# EAGLE design MS-v4.1 (EAGLE 5.00)
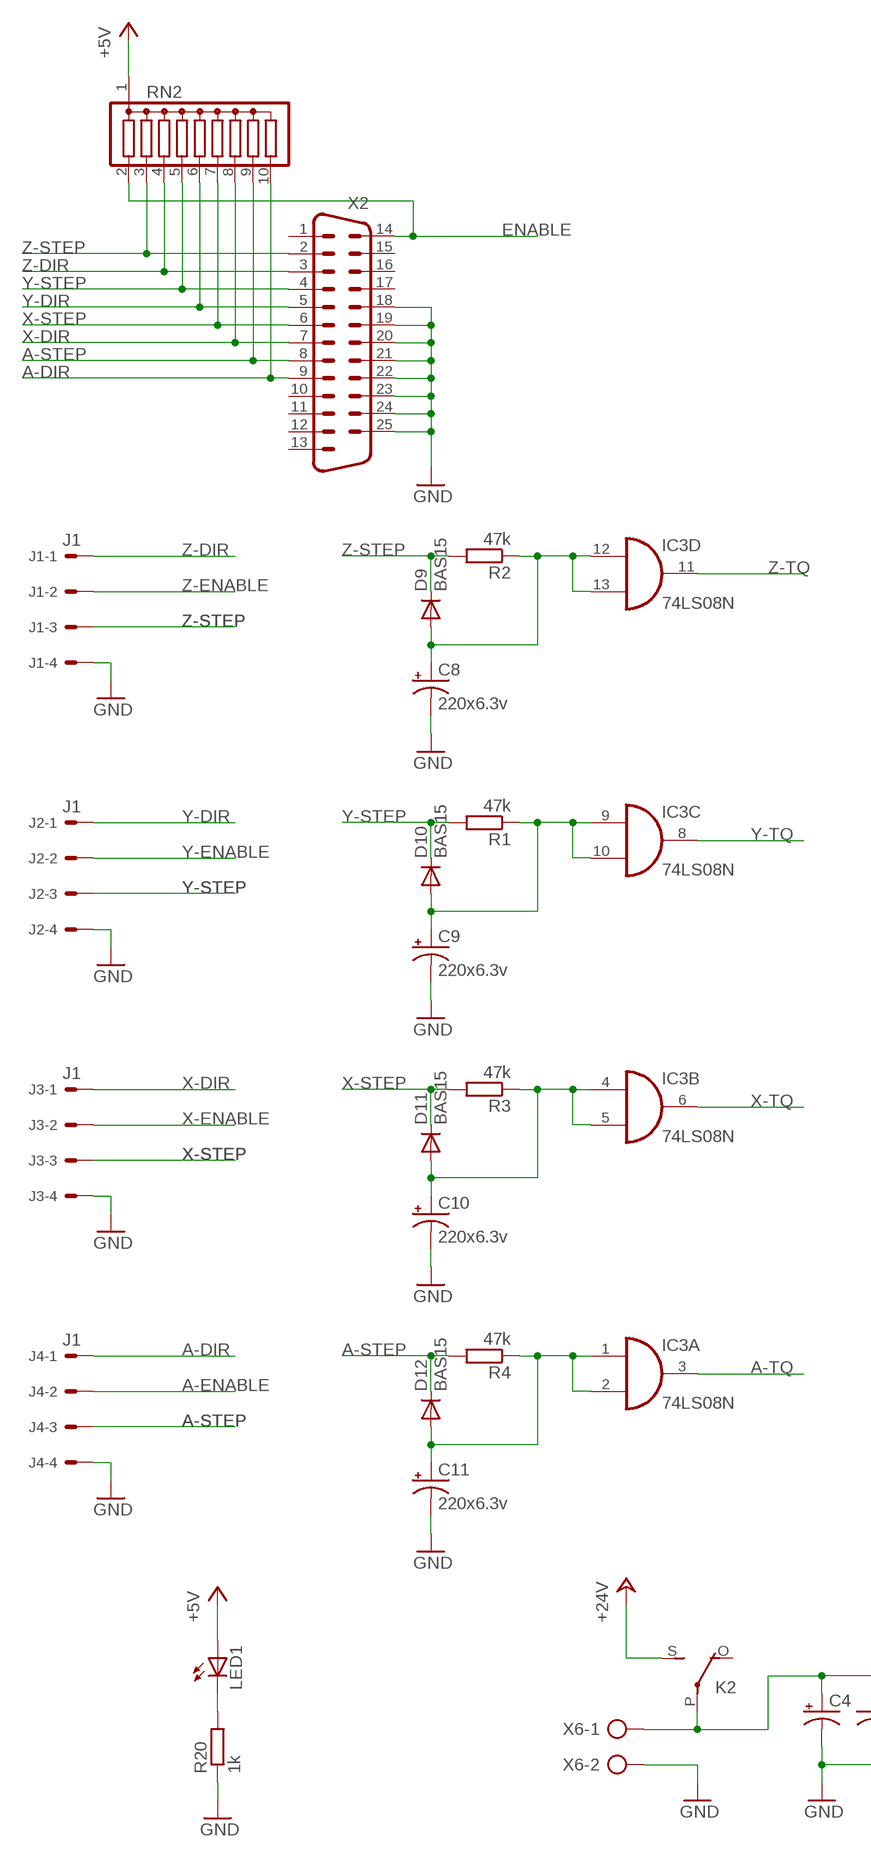
[diagram p0: schematic, sheet 1, part 1 of 2]
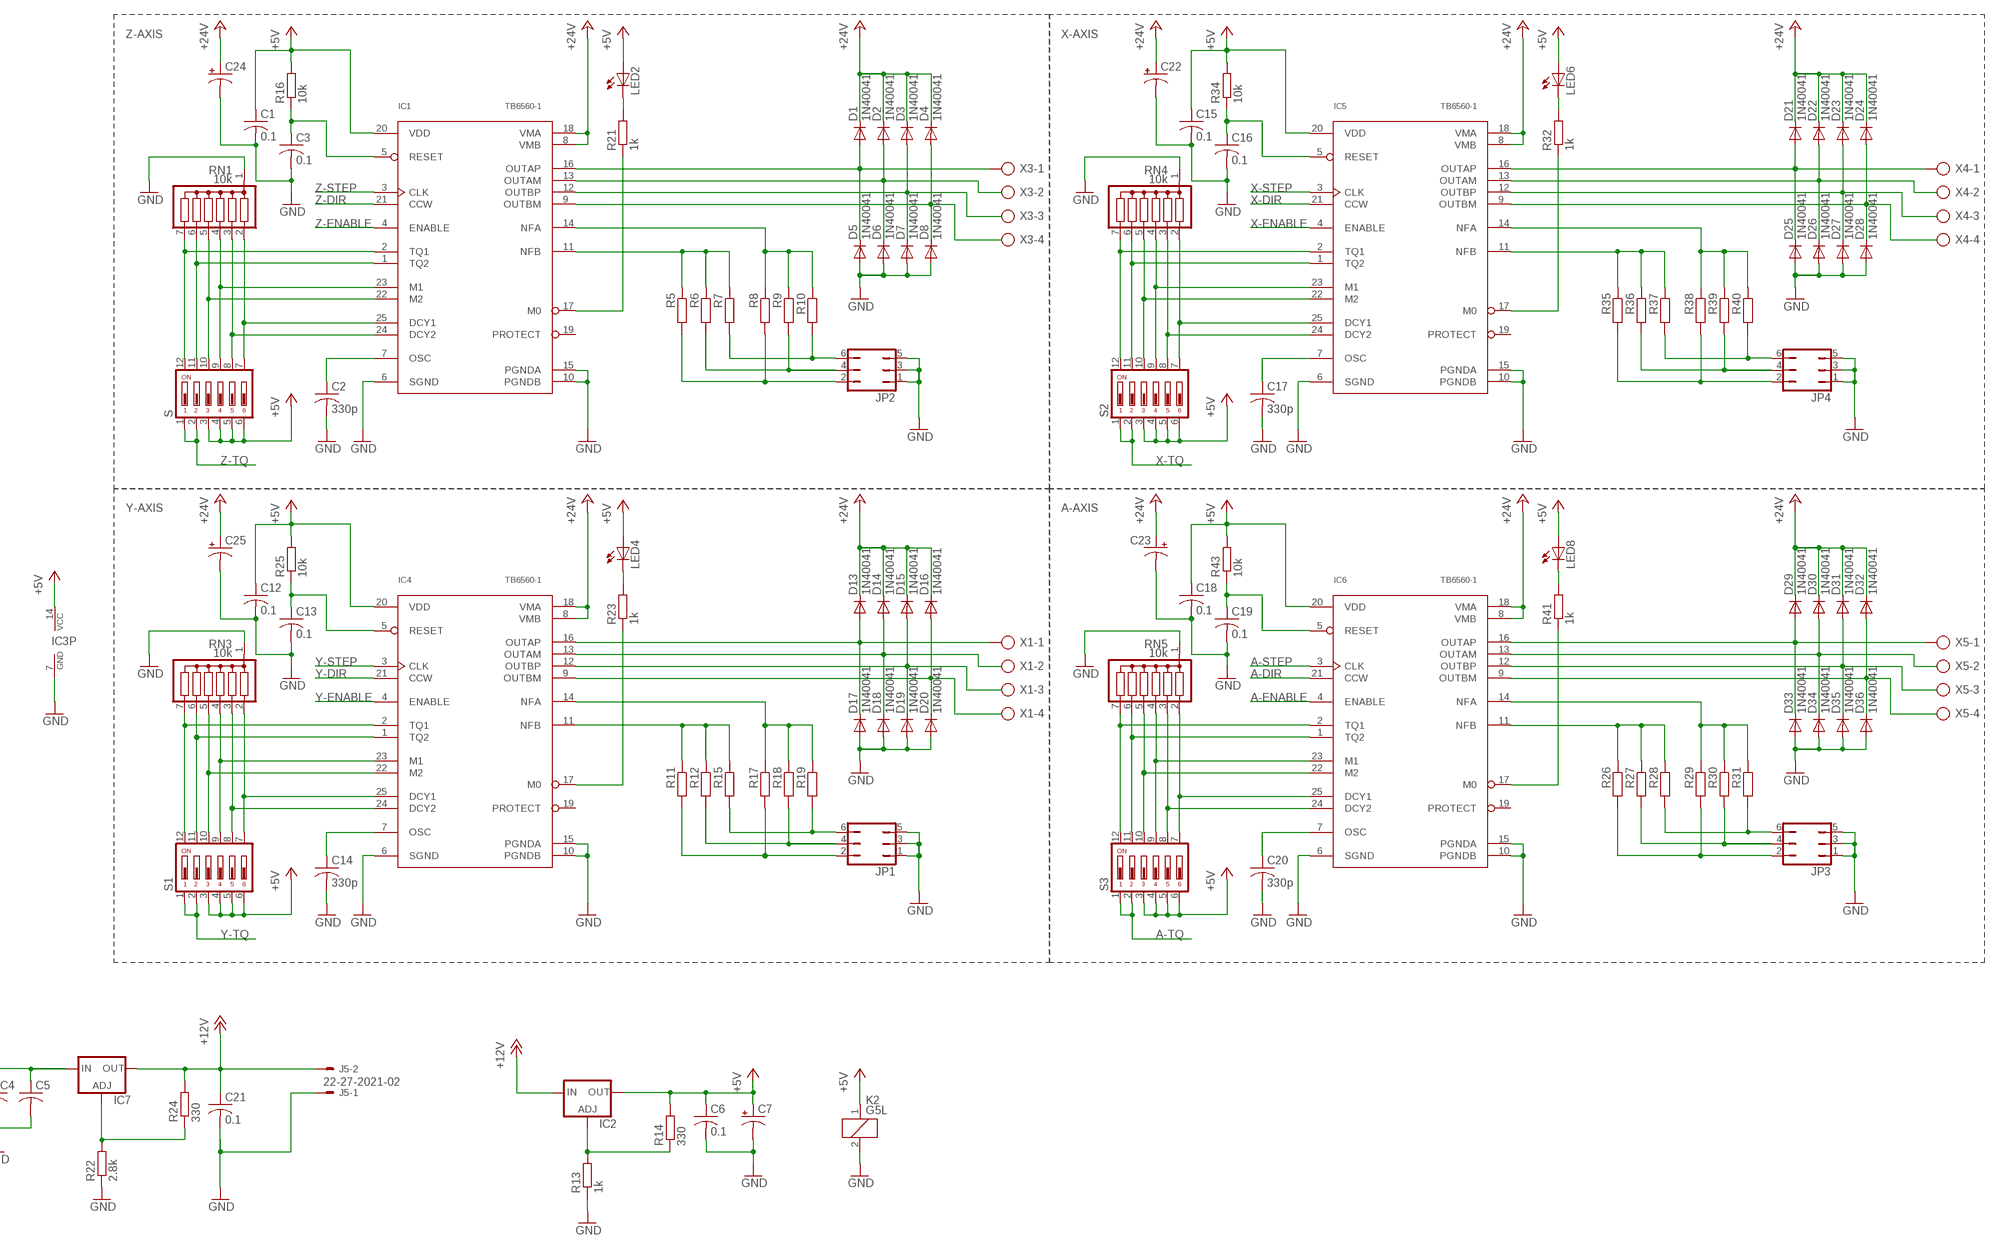
[diagram p1: schematic, sheet 1, part 2 of 2]

## Parts
C1  0.1  C-US050-025X075  [C050-025X075]
C2  330p  C-US050-025X075  [C050-025X075]
C3  0.1  C-US050-025X075  [C050-025X075]
C4  CPOL-USE5-10.5  [E5-10,5]
C5  C-US050-025X075  [C050-025X075]
C6  0.1  C-US050-025X075  [C050-025X075]
C7  CPOL-USE5-10.5  [E5-10,5]
C8  220x6.3v  CPOL-USE2.5-5  [E2,5-5]
C9  220x6.3v  CPOL-USE2.5-5  [E2,5-5]
C10  220x6.3v  CPOL-USE2.5-5  [E2,5-5]
C11  220x6.3v  CPOL-USE2.5-5  [E2,5-5]
C12  0.1  C-US050-025X075  [C050-025X075]
C13  0.1  C-US050-025X075  [C050-025X075]
C14  330p  C-US050-025X075  [C050-025X075]
C15  0.1  C-US050-025X075  [C050-025X075]
C16  0.1  C-US050-025X075  [C050-025X075]
C17  330p  C-US050-025X075  [C050-025X075]
C18  0.1  C-US050-025X075  [C050-025X075]
C19  0.1  C-US050-025X075  [C050-025X075]
C20  330p  C-US050-025X075  [C050-025X075]
C21  0.1  C-US050-025X075  [C050-025X075]
C22  CPOL-USE5-10.5  [E5-10,5]
C23  CPOL-USE5-10.5  [E5-10,5]
C24  CPOL-USE5-10.5  [E5-10,5]
C25  CPOL-USE5-10.5  [E5-10,5]
D1  1N40041  [DO41-10]
D2  1N40041  [DO41-10]
D3  1N40041  [DO41-10]
D4  1N40041  [DO41-10]
D5  1N40041  [DO41-10]
D6  1N40041  [DO41-10]
D7  1N40041  [DO41-10]
D8  1N40041  [DO41-10]
D9  BAS15  [DO34-7]
D10  BAS15  [DO34-7]
D11  BAS15  [DO34-7]
D12  BAS15  [DO34-7]
D13  1N40041  [DO41-10]
D14  1N40041  [DO41-10]
D15  1N40041  [DO41-10]
D16  1N40041  [DO41-10]
D17  1N40041  [DO41-10]
D18  1N40041  [DO41-10]
D19  1N40041  [DO41-10]
D20  1N40041  [DO41-10]
D21  1N40041  [DO41-10]
D22  1N40041  [DO41-10]
D23  1N40041  [DO41-10]
D24  1N40041  [DO41-10]
D25  1N40041  [DO41-10]
D26  1N40041  [DO41-10]
D27  1N40041  [DO41-10]
D28  1N40041  [DO41-10]
D29  1N40041  [DO41-10]
D30  1N40041  [DO41-10]
D31  1N40041  [DO41-10]
D32  1N40041  [DO41-10]
D33  1N40041  [DO41-10]
D34  1N40041  [DO41-10]
D35  1N40041  [DO41-10]
D36  1N40041  [DO41-10]
IC1  TB6560-1  [HZIP25-P-1.27]
IC2  LM317TS  [317TS]
IC3  74LS08N  [DIL14]
IC4  TB6560-1  [HZIP25-P-1.27]
IC5  TB6560-1  [HZIP25-P-1.27]
IC6  TB6560-1  [HZIP25-P-1.27]
IC7  LM317TS  [317TS]
J1  J1  22-27-2041-04  [6410-04]
J2  J1  22-27-2041-04  [6410-04]
J3  J1  22-27-2041-04  [6410-04]
J4  J1  22-27-2041-04  [6410-04]
J5  22-27-2021-02  [6410-02]
JP1  JP3Q  [JP3Q]
JP2  JP3Q  [JP3Q]
JP3  JP3Q  [JP3Q]
JP4  JP3Q  [JP3Q]
K2  G5L  [G5LE]
LED1  LED3MM  [LED3MM]
LED2  LED3MM  [LED3MM]
LED4  LED3MM  [LED3MM]
LED6  LED3MM  [LED3MM]
LED8  LED3MM  [LED3MM]
R1  47k  R-EU_0207/10  [0207/10]
R2  47k  R-EU_0207/10  [0207/10]
R3  47k  R-EU_0207/10  [0207/10]
R4  47k  R-EU_0207/10  [0207/10]
R5  R-EU_0207/12  [0207/12]
R6  R-EU_0207/12  [0207/12]
R7  R-EU_0207/12  [0207/12]
R8  R-EU_0207/12  [0207/12]
R9  R-EU_0207/12  [0207/12]
R10  R-EU_0207/12  [0207/12]
R11  R-EU_0207/12  [0207/12]
R12  R-EU_0207/12  [0207/12]
R13  1k  R-EU_0207/2V  [0207/2V]
R14  330  R-EU_0207/2V  [0207/2V]
R15  R-EU_0207/12  [0207/12]
R16  10k  R-EU_0207/5V  [0207/5V]
R17  R-EU_0207/12  [0207/12]
R18  R-EU_0207/12  [0207/12]
R19  R-EU_0207/12  [0207/12]
R20  1k  R-EU_0207/2V  [0207/2V]
R21  1k  R-EU_0207/15  [0207/15]
R22  2.8k  R-EU_0207/2V  [0207/2V]
R23  1k  R-EU_0207/15  [0207/15]
R24  330  R-EU_0207/2V  [0207/2V]
R25  10k  R-EU_0207/5V  [0207/5V]
R26  R-EU_0207/12  [0207/12]
R27  R-EU_0207/12  [0207/12]
R28  R-EU_0207/12  [0207/12]
R29  R-EU_0207/12  [0207/12]
R30  R-EU_0207/12  [0207/12]
R31  R-EU_0207/12  [0207/12]
R32  1k  R-EU_0207/15  [0207/15]
R34  10k  R-EU_0207/5V  [0207/5V]
R35  R-EU_0207/12  [0207/12]
R36  R-EU_0207/12  [0207/12]
R37  R-EU_0207/12  [0207/12]
R38  R-EU_0207/12  [0207/12]
R39  R-EU_0207/12  [0207/12]
R40  R-EU_0207/12  [0207/12]
R41  1k  R-EU_0207/15  [0207/15]
R43  10k  R-EU_0207/5V  [0207/5V]
RN1  10k  G06R  [SIL7]
RN2  G09R  [SIL10]
RN3  10k  G06R  [SIL7]
RN4  10k  G06R  [SIL7]
RN5  10k  G06R  [SIL7]
S  DIP06YL  [DIP06YL]
S1  DIP06YL  [DIP06YL]
S2  DIP06YL  [DIP06YL]
S3  DIP06YL  [DIP06YL]
X1  AK500/4  [AK500/4]
X2  M25HP  [M25HP]
X3  AK500/4  [AK500/4]
X4  AK500/4  [AK500/4]
X5  AK500/4  [AK500/4]
X6  AK500/2  [AK500/2]

## Nets
+5V: C1.1 C6.1 C7.+ C12.1 C15.1 C18.1 IC1.20(VDD) IC2.2(OUT) IC3.14(P:VCC) IC4.20(VDD) IC5.20(VDD) IC6.20(VDD) K2.1 LED1.A LED2.A LED4.A LED6.A LED8.A R14.2 R16.2 R25.2 R34.2 R43.2 RN2.1 S1.3 S1.4 S1.5 S1.6 S2.3 S2.4 S2.5 S2.6 S3.3 S3.4 S3.5 S3.6 S.3 S.4 S.5 S.6
+12V: C21.1 IC2.3(IN) IC7.2(OUT) J5.2 R24.2
+24V: C22.+ C23.+ C24.+ C25.+ D1.C D2.C D3.C D4.C D13.C D14.C D15.C D16.C D21.C D22.C D23.C D24.C D29.C D30.C D31.C D32.C IC1.8(VMB) IC1.18(VMA) IC4.8(VMB) IC4.18(VMA) IC5.8(VMB) IC5.18(VMA) IC6.8(VMB) IC6.18(VMA) K2.S(2:S)
A-DIR: IC6.21(CCW) J4.1 RN2.10 X2.9
A-ENABLE: IC6.4(ENABLE) J4.2
A-STEP: D12.C IC6.3(CLK) J4.3 R4.2 RN2.9 X2.8
A-TQ: IC3.3(A:O) S3.1 S3.2
DCY1: IC1.25(DCY1) RN1.2 S.7
DCY2: IC1.24(DCY2) RN1.3 S.8
DCY3: IC4.25(DCY1) RN3.2 S1.7
DCY4: IC4.24(DCY2) RN3.3 S1.8
DCY5: IC5.25(DCY1) RN4.2 S2.7
DCY6: IC5.24(DCY2) RN4.3 S2.8
DCY7: IC6.25(DCY1) RN5.2 S3.7
DCY8: IC6.24(DCY2) RN5.3 S3.8
ENABLE: RN2.2 X2.14
GND: C1.2 C2.2 C3.2 C4.- C5.2 C6.2 C7.- C8.- C9.- C10.- C11.- C12.2 C13.2 C14.2 C15.2 C16.2 C17.2 C18.2 C19.2 C20.2 C21.2 C22.- C23.- C24.- C25.- D5.A D6.A D7.A D8.A D17.A D18.A D19.A D20.A D25.A D26.A D27.A D28.A D33.A D34.A D35.A D36.A IC1.6(SGND) IC1.10(PGNDB) IC1.15(PGNDA) IC3.7(P:GND) IC4.6(SGND) IC4.10(PGNDB) IC4.15(PGNDA) IC5.6(SGND) IC5.10(PGNDB) IC5.15(PGNDA) IC6.6(SGND) IC6.10(PGNDB) IC6.15(PGNDA) J1.4 J2.4 J3.4 J4.4 J5.1 JP1.1 JP1.3 JP1.5 JP2.1 JP2.3 JP2.5 JP3.1 JP3.3 JP3.5 JP4.1 JP4.3 JP4.5 K2.2 R13.1 R20.1 R22.1 RN1.1 RN3.1 RN4.1 RN5.1 X2.18 X2.19 X2.20 X2.21 X2.22 X2.23 X2.24 X2.25 X6.2
M1: IC1.23(M1) RN1.4 S.9
M2: IC1.22(M2) RN1.5 S.10
M3: IC4.23(M1) RN3.4 S1.9
M4: IC4.22(M2) RN3.5 S1.10
M5: IC5.23(M1) RN4.4 S2.9
M6: IC5.22(M2) RN4.5 S2.10
M7: IC6.23(M1) RN5.4 S3.9
M8: IC6.22(M2) RN5.5 S3.10
N$1: IC1.11(NFB) R5.1 R6.1 R7.1
N$2: IC1.14(NFA) R8.1 R9.1 R10.1
N$3: JP2.6 R7.2 R10.2
N$4: JP2.4 R6.2 R9.2
N$5: JP2.2 R5.2 R8.2
N$6: IC6.11(NFB) R26.1 R27.1 R28.1
N$7: IC6.14(NFA) R29.1 R30.1 R31.1
N$8: JP3.6 R28.2 R31.2
N$9: C2.1 IC1.7(OSC)
N$10: IC1.17(M0) R21.1
N$11: IC7.1(ADJ) R22.2 R24.1
N$14: D1.A D5.C IC1.16(OUTAP) X3.1
N$15: D2.A D6.C IC1.13(OUTAM) X3.2
N$16: D3.A D7.C IC1.12(OUTBP) X3.3
N$17: D4.A D8.C IC1.9(OUTBM) X3.4
N$19: C4.+ C5.1 IC7.3(IN) K2.P(2:P) X6.1
N$20: IC2.1(ADJ) R13.2 R14.1
N$21: C8.+ D9.A IC3.12(D:I0) IC3.13(D:I1) R2.1
N$22: C9.+ D10.A IC3.9(C:I0) IC3.10(C:I1) R1.1
N$23: LED1.K(C) R20.2
N$24: LED2.K(C) R21.2
N$26: C10.+ D11.A IC3.4(B:I0) IC3.5(B:I1) R3.1
N$27: C11.+ D12.A IC3.1(A:I0) IC3.2(A:I1) R4.1
N$28: C3.1 IC1.5(RESET) R16.1
N$29: IC4.11(NFB) R11.1 R12.1 R15.1
N$30: IC4.14(NFA) R17.1 R18.1 R19.1
N$31: JP1.6 R15.2 R19.2
N$32: JP3.4 R27.2 R30.2
N$33: JP1.4 R12.2 R18.2
N$34: JP1.2 R11.2 R17.2
N$35: JP3.2 R26.2 R29.2
N$36: IC5.11(NFB) R35.1 R36.1 R37.1
N$37: D13.A D17.C IC4.16(OUTAP) X1.1
N$38: D14.A D18.C IC4.13(OUTAM) X1.2
N$39: D15.A D19.C IC4.12(OUTBP) X1.3
N$40: D16.A D20.C IC4.9(OUTBM) X1.4
N$41: LED4.K(C) R23.2
N$43: C14.1 IC4.7(OSC)
N$44: C13.1 IC4.5(RESET) R25.1
N$45: IC4.17(M0) R23.1
N$47: IC5.14(NFA) R38.1 R39.1 R40.1
N$48: JP4.6 R37.2 R40.2
N$49: JP4.4 R36.2 R39.2
N$50: JP4.2 R35.2 R38.2
N$55: D21.A D25.C IC5.16(OUTAP) X4.1
N$56: D22.A D26.C IC5.13(OUTAM) X4.2
N$57: D23.A D27.C IC5.12(OUTBP) X4.3
N$58: D24.A D28.C IC5.9(OUTBM) X4.4
N$59: LED6.K(C) R32.2
N$61: C17.1 IC5.7(OSC)
N$62: C16.1 IC5.5(RESET) R34.1
N$63: IC5.17(M0) R32.1
N$73: D29.A D33.C IC6.16(OUTAP) X5.1
N$74: D30.A D34.C IC6.13(OUTAM) X5.2
N$75: D31.A D35.C IC6.12(OUTBP) X5.3
N$76: D32.A D36.C IC6.9(OUTBM) X5.4
N$77: LED8.K(C) R41.2
N$79: C20.1 IC6.7(OSC)
N$80: C19.1 IC6.5(RESET) R43.1
N$81: IC6.17(M0) R41.1
TQ1: IC1.1(TQ2) RN1.6 S.11
TQ2: IC1.2(TQ1) RN1.7 S.12
TQ3: IC4.1(TQ2) RN3.6 S1.11
TQ4: IC4.2(TQ1) RN3.7 S1.12
TQ5: IC5.1(TQ2) RN4.6 S2.11
TQ6: IC5.2(TQ1) RN4.7 S2.12
TQ7: IC6.1(TQ2) RN5.6 S3.11
TQ8: IC6.2(TQ1) RN5.7 S3.12
X-DIR: IC5.21(CCW) J3.1 RN2.8 X2.7
X-ENABLE: IC5.4(ENABLE) J3.2
X-STEP: D11.C IC5.3(CLK) J3.3 R3.2 RN2.7 X2.6
X-TQ: IC3.6(B:O) S2.1 S2.2
Y-DIR: IC4.21(CCW) J2.1 RN2.6 X2.5
Y-ENABLE: IC4.4(ENABLE) J2.2
Y-STEP: D10.C IC4.3(CLK) J2.3 R1.2 RN2.5 X2.4
Y-TQ: IC3.8(C:O) S1.1 S1.2
Z-DIR: IC1.21(CCW) J1.1 RN2.4 X2.3
Z-ENABLE: IC1.4(ENABLE) J1.2
Z-STEP: D9.C IC1.3(CLK) J1.3 R2.2 RN2.3 X2.2
Z-TQ: IC3.11(D:O) S.1 S.2
Unconnected: IC1.19(PROTECT) IC4.19(PROTECT) IC5.19(PROTECT) IC6.19(PROTECT) K2.O(2:O) X2.1 X2.10 X2.11 X2.12 X2.13 X2.15 X2.16 X2.17

## Notes on the sheet
- Z-AXIS | X-AXIS
- Y-AXIS | A-AXIS

## Library data of the parts
C1-C3 C5 C6 C12-C21 = rcl:C-US: CAPACITOR, American symbol
C4 C7-C11 C22-C25 = rcl:CPOL-US: POLARIZED CAPACITOR, American symbol
D1-D8 D13-D36 = diode:1N4004: DIODE general purpose rectifier, 1 A
D9-D12 = diode:BAS15: DIODE high speed
IC1 IC4-IC6 = toshiba:TB6560
IC2 IC7 = v-reg:LM317TS: VOLTAGE REGULATOR
IC3 = 74xx-eu:74*08: Quad 2-input AND gate
J1-J4 = con-molex:22-?-04: CONNECTOR wire to board 2.54 mm (.1 inch) pitch header
J5 = con-molex:22-?-02: CONNECTOR wire to board 2.54 mm (.1 inch) pitch header
JP1-JP4 = jumper:JP3Q: JUMPER
K2 = relay:G5L: RELAY 1 x switch, 10 A/120 V AC, 8 A/30 V ADC, Omron
LED1 LED2 LED4 LED6 LED8 = led:LED: LED OSRAM: - CHIPLED LG R971, LG N971, LY N971, LG Q971, LY Q971, LO R971, LY R971 LH N974, LH R974 LS Q976, LO Q976, LY Q976 LO Q996 - Hyper CHIPLED LW Q18S LB Q993, LB Q99A, LB R99A - SideLED LS A670, LO A670, LY A670, LG A670, LP A670 LB A673, LV A673, LT A673, LW A673 LH A674 LY A675 LS A676, LA A676, LO A676, LY A676, LW A676 LS A679, LY A679, LG A679 - Hyper Micro SIDELED® LS Y876, LA Y876, LO Y876, LY Y876 LT Y87S - SmartLED LW L88C, LW L88S LB L89C, LB L89S, LG L890 LS L89K, LO L89K, LY L89K LS L896, LA L896, LO L896, LY L896 - TOPLED LS T670, LO T670, LY T670, LG T670, LP T670 LSG T670, LSP T670, LSY T670, LOP T670, LYG T670 LG T671, LOG T671, LSG T671 LB T673, LV T673, LT T673, LW T673 LH T674 LS T676, LA T676, LO T676, LY T676, LB T676, LH T676, LSB T676, LW T676 LB T67C, LV T67C, LT T67C, LS T67K, LO T67K, LY T67K, LW E67C LS E67B, LA E67B, LO E67B, LY E67B, LB E67C, LV E67C, LT E67C LW T67C LS T679, LY T679, LG T679 LS T770, LO T770, LY T770, LG T770, LP T770 LB T773, LV T773, LT T773, LW T773 LH T774 LS E675, LA E675, LY E675, LS T675 LS T776, LA T776, LO T776, LY T776, LB T776 LHGB T686 LT T68C, LB T68C - Hyper Mini TOPLED® LB M676 - Mini TOPLED Santana® LG M470 LS M47K, LO M47K, LY M47K Source: http://www.osram.convergy.de - LUMILED® LXK2-PW12-R00, LXK2-PW12-S00, LXK2-PW14-U00, LXK2-PW14-V00 LXK2-PM12-R00, LXK2-PM12-S00, LXK2-PM14-U00 LXK2-PE12-Q00, LXK2-PE12-R00, LXK2-PE12-S00, LXK2-PE14-T00, LXK2-PE14-U00 LXK2-PB12-K00, LXK2-PB12-L00, LXK2-PB12-M00, LXK2-PB14-N00, LXK2-PB14-P00, LXK2-PB14-Q00 LXK2-PR12-L00, LXK2-PR12-M00, LXK2-PR14-Q00, LXK2-PR14-R00 LXK2-PD12-Q00, LXK2-PD12-R00, LXK2-PD12-S00 LXK2-PH12-R00, LXK2-PH12-S00 LXK2-PL12-P00, LXK2-PL12-Q00, LXK2-PL12-R00 Source: www.luxeon.com
R1-R32 R34-R41 R43 = rcl:R-EU_: RESISTOR, European symbol
RN1 RN3-RN5 = resistor-sil:G06R: SIL RESISTOR
RN2 = resistor-sil:G09R: SIL RESISTOR
S S1-S3 = switch-dil:DIP06YL: DIL/CODE SWITCH
X1 X3-X5 = con-ptr500:AK500/4: CONNECTOR
X2 = con-subd:M25: SUB-D
X6 = con-ptr500:AK500/2: CONNECTOR

## Board
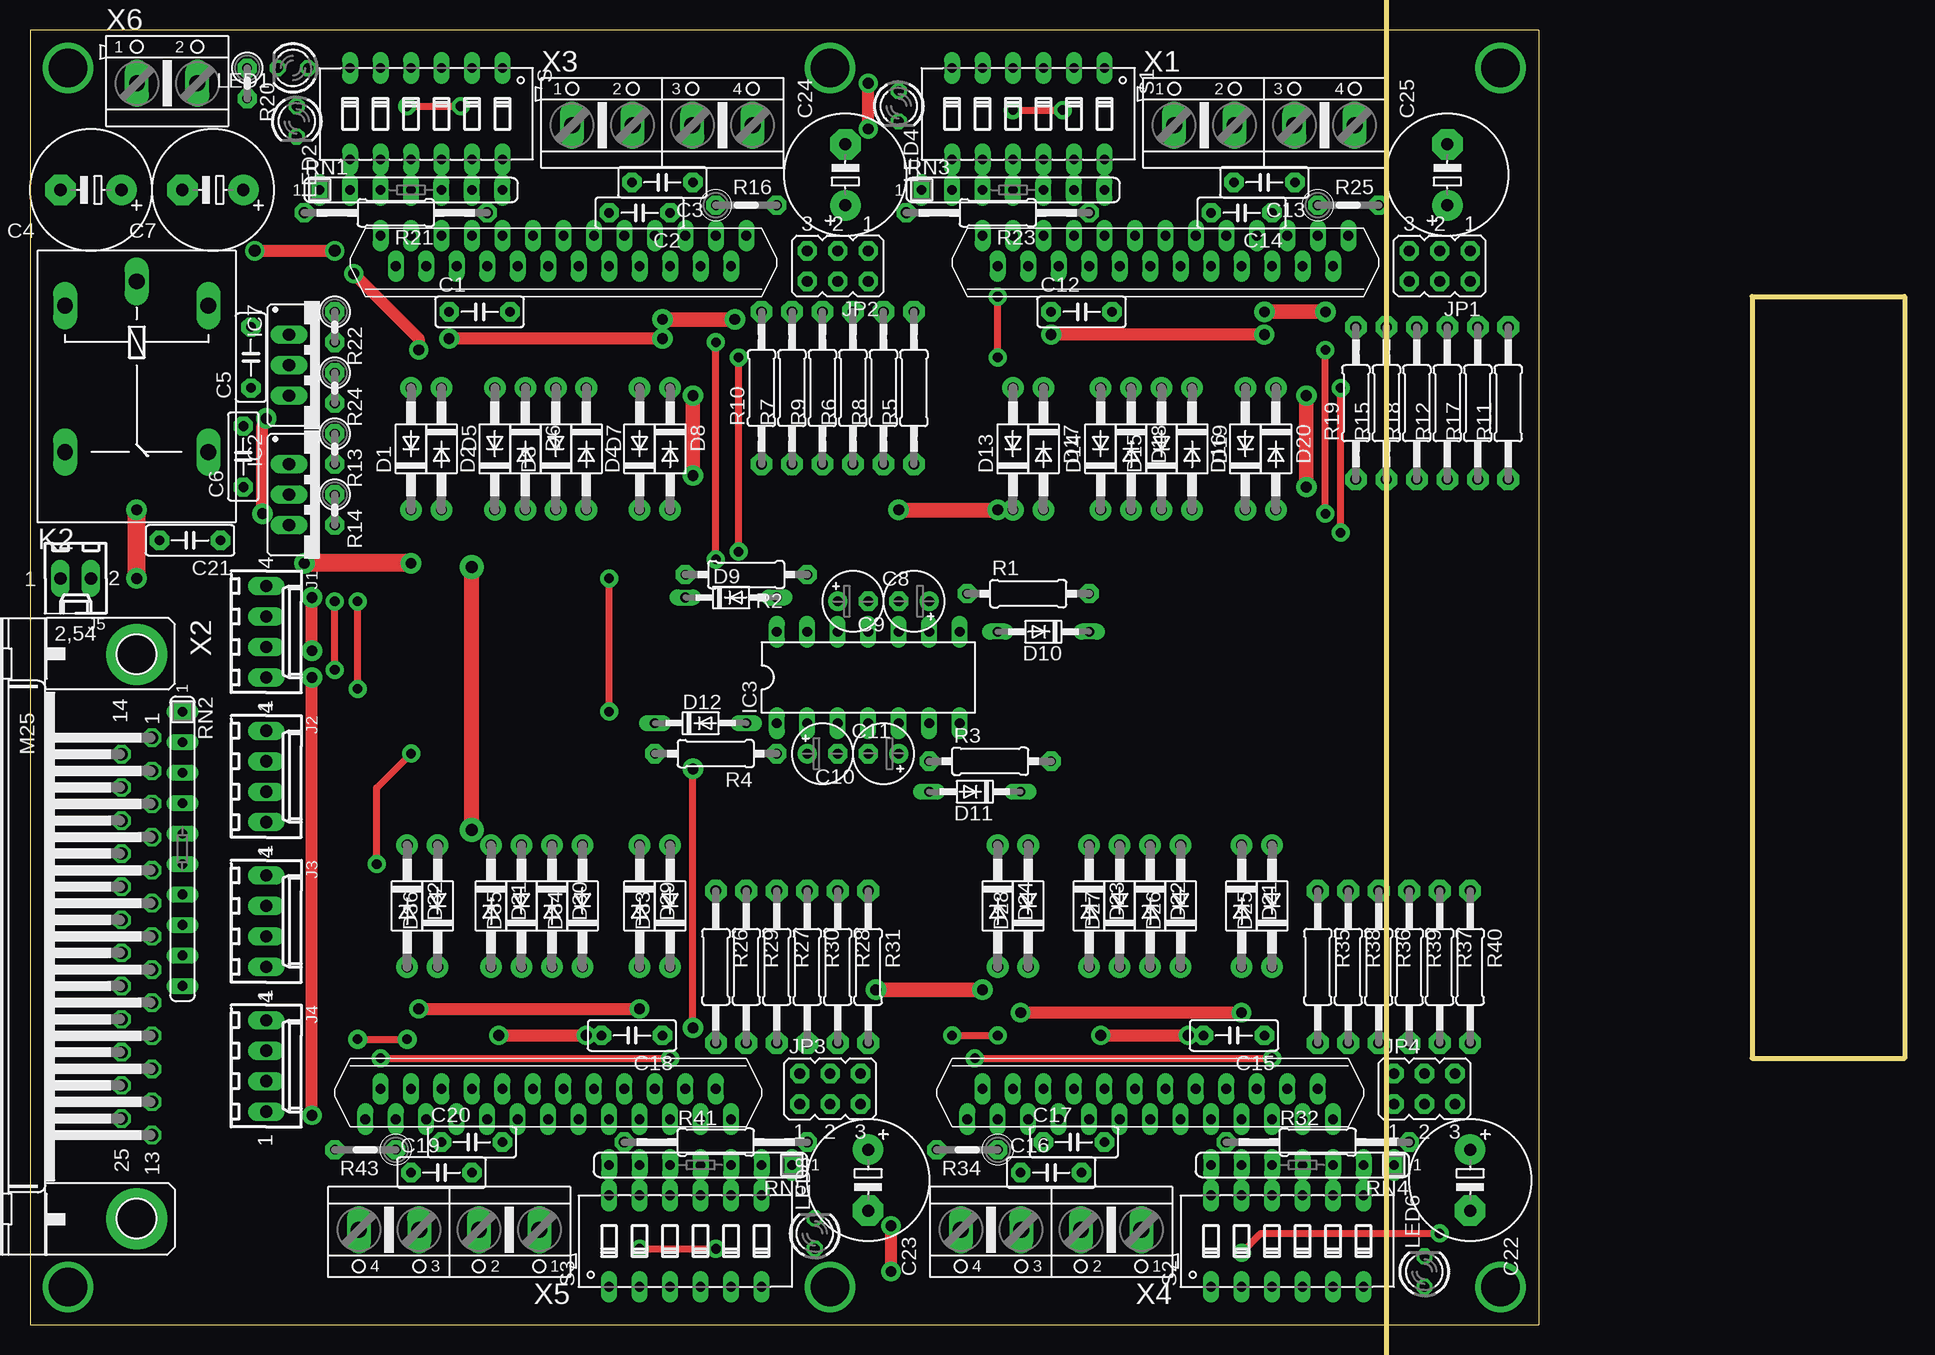
[diagram p2: board, top side]
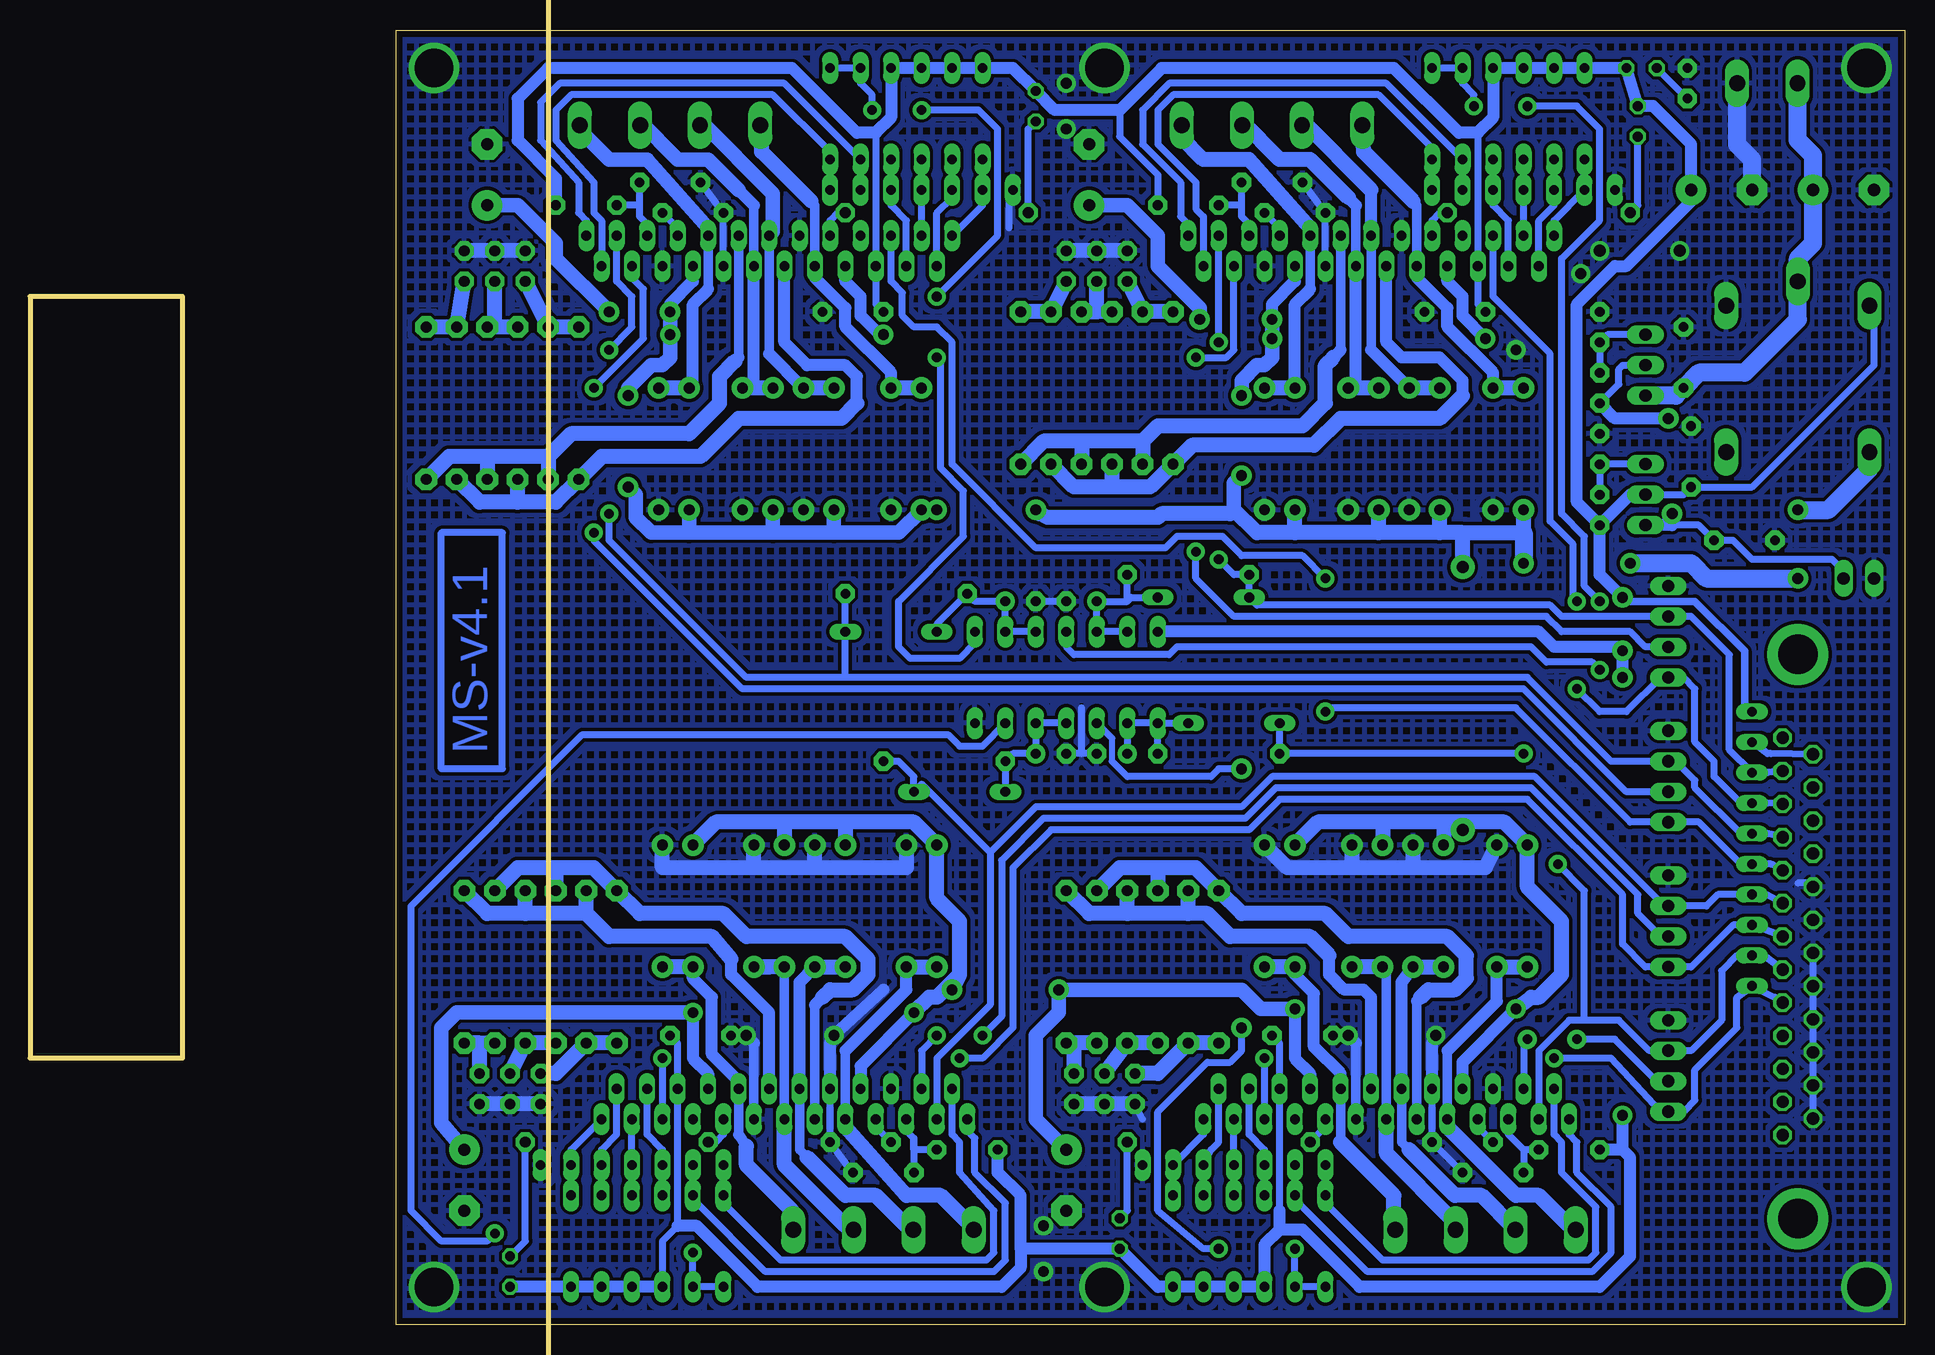
[diagram p3: board, bottom side, seen from below]

Size 156.21 x 107.95 mm. Coordinates in mm from the lower left corner, seen from the top.
Outline: 0,0 125.73,0 125.73,107.95 0,107.95 0,0
Outline: 156.21,85.72 156.21,22.23 143.51,22.23 143.51,85.72 156.21,85.72
Copper layers (1*16): Top 0.035mm / dielectric 1.5mm / Bottom 0.035mm
Design rules "default *": minimum track width 10mil, minimum drill 24mil, track to track 8mil, track to pad 8mil, pad to pad 8mil, via to via 8mil, smd to smd 8mil, copper to edge 20mil, drill to drill 10mil, minimum pad ring 10mil, minimum via ring 8mil, stop-mask expansion 4mil, vias tented up to drill 0mil, thermal gap 10mil
Milling: 1 lines

### Footprints (pad centres in the part's own frame; a part is rotated, then mirrored left to right if it is on the bottom)
C050-025X075 = drill 0.8 pad 1.6 octagon: 1 -2.54,0; 2 2.54,0
E5-10,5 = drill 1.016 pad 2.54 round: + -2.54,0 | drill 1.016 pad 2.54 octagon: - 2.54,0
E2,5-5 = drill 0.813 pad 1.6 round: + -1.27,0 | drill 0.813 pad 1.6 octagon: - 1.27,0
DO41-10 = drill 0.9 pad 1.8 round: A 5.08,0; C -5.08,0
DO34-7 = drill 0.813 long: A 3.81,0; C -3.81,0
HZIP25-P-1.27 = drill 0.813 long: 1 -17.78,-5.08; 2 -16.51,-2.54; 3 -15.24,-5.08; 4 -13.97,-2.54; 5 -12.7,-5.08; 6 -11.43,-2.54; 7 -10.16,-5.08; 8 -8.89,-2.54; 9 -7.62,-5.08; 10 -6.35,-2.54; 11 -5.08,-5.08; 12 -3.81,-2.54; 13 -2.54,-5.08; 14 -1.27,-2.54; 15 0,-5.08; 16 1.27,-2.54; 17 2.54,-5.08; 18 3.81,-2.54; 19 5.08,-5.08; 20 6.35,-2.54; 21 7.62,-5.08; 22 8.89,-2.54; 23 10.16,-5.08; 24 11.43,-2.54; 25 12.7,-5.08
317TS = drill 1.016 long: 1 -2.54,-2.54; 2 0,-2.54; 3 2.54,-2.54
DIL14 = drill 0.813 long: 1 -7.62,-3.81; 2 -5.08,-3.81; 3 -2.54,-3.81; 4 0,-3.81; 5 2.54,-3.81; 6 5.08,-3.81; 7 7.62,-3.81; 8 7.62,3.81; 9 5.08,3.81; 10 2.54,3.81; 11 0,3.81; 12 -2.54,3.81; 13 -5.08,3.81; 14 -7.62,3.81
6410-04 = drill 1.016 long: 1 3.81,0; 2 1.27,0; 3 -1.27,0; 4 -3.81,0
6410-02 = drill 1.016 long: 1 1.27,0; 2 -1.27,0
JP3Q = drill 0.9 pad 1.6 octagon: 1 -2.54,-1.27; 2 -2.54,1.27; 3 0,-1.27; 4 0,1.27; 5 2.54,-1.27; 6 2.54,1.27
G5LE = drill 1.321 long: 1 -7.493,-5.969; 2 -7.493,5.969; O 4.699,5.969; P -9.525,0; S 4.699,-5.969
LED3MM = drill 0.813 octagon: A -1.27,0; K 1.27,0
0207/10 = drill 0.8 pad 1.6 octagon: 1 -5.08,0; 2 5.08,0
0207/12 = drill 0.9 pad 1.8 octagon: 1 -6.35,0; 2 6.35,0
0207/2V = drill 0.8 pad 1.6 octagon: 1 -1.27,0; 2 1.27,0
0207/5V = drill 0.8 pad 1.6 octagon: 1 -2.54,0; 2 2.54,0
0207/15 = drill 0.9 pad 1.6 octagon: 1 -7.62,0; 2 7.62,0
SIL7 = drill 0.813 long: 1 -7.62,0; 2 -5.08,0; 3 -2.54,0; 4 0,0; 5 2.54,0; 6 5.08,0; 7 7.62,0
SIL10 = drill 0.813 long: 1 -11.43,0; 2 -8.89,0; 3 -6.35,0; 4 -3.81,0; 5 -1.27,0; 6 1.27,0; 7 3.81,0; 8 6.35,0; 9 8.89,0; 10 11.43,0
DIP06YL = drill 0.813 long: 1 -6.35,-3.81; 2 -3.81,-3.81; 3 -1.27,-3.81; 4 1.27,-3.81; 5 3.81,-3.81; 6 6.35,-3.81; 7 6.35,3.81; 8 3.81,3.81; 9 1.27,3.81; 10 -1.27,3.81; 11 -3.81,3.81; 12 -6.35,3.81
AK500/4 = drill 1.321 long: 1 -7.518,0; 2 -2.489,0; 3 2.489,0; 4 7.518,0
M25HP = drill 1.016 octagon: 1 -16.561,1.27; 2 -13.792,1.27; 3 -11.049,1.27; 4 -8.28,1.27; 5 -5.512,1.27; 6 -2.769,1.27; 7 0,1.27; 8 2.769,1.27; 9 5.512,1.27; 10 8.28,1.27; 11 11.049,1.27; 12 13.792,1.27; 13 16.561,1.27; 14 -15.189,-1.27; 15 -12.421,-1.27; 16 -9.652,-1.27; 17 -6.909,-1.27; 18 -4.14,-1.27; 19 -1.372,-1.27; 20 1.372,-1.27; 21 4.14,-1.27; 22 6.909,-1.27; 23 9.652,-1.27; 24 12.421,-1.27; 25 15.189,-1.27 | drill 3.302 pad 5.08 round: G1 -23.52,0; G2 23.52,0
AK500/2 = drill 1.321 long: 1 -2.515,0; 2 2.515,0

### Placement (x,y rotation side)
C1  37.47,84.45 0 top
C2  50.8,92.71 180 top
C3  52.7,95.25 180 top
C4  5.08,94.61 180 top
C5  18.41,80.64 90 top
C6  17.78,72.39 90 top
C7  15.24,94.61 180 top
C8  68.58,60.33 0 top
C9  73.66,60.33 180 top
C10  71.12,47.62 180 top
C11  66.04,47.62 0 top
C12  87.63,84.45 0 top
C13  102.87,95.25 180 top
C14  100.97,92.71 180 top
C15  100.33,24.13 180 top
C16  85.09,12.7 0 top
C17  87,15.24 0 top
C18  50.16,24.13 180 top
C19  34.29,12.7 0 top
C20  36.83,15.24 0 top
C21  13.34,65.41 180 top
C22  120.02,12.06 270 top
C23  69.85,12.06 270 top
C24  67.94,95.89 90 top
C25  118.11,95.89 90 top
D1  31.75,73.03 90 top
D2  38.73,73.03 90 top
D3  43.81,73.03 90 top
D4  50.8,73.03 90 top
D5  34.29,73.03 270 top
D6  41.27,73.03 270 top
D7  46.35,73.03 270 top
D8  53.34,73.03 270 top
D9  58.42,60.64 0 top
D10  84.45,57.78 180 top
D11  78.74,44.45 180 top
D12  55.88,50.16 0 top
D13  81.92,73.03 90 top
D14  89.22,73.03 90 top
D15  94.3,73.03 90 top
D16  101.28,73.03 90 top
D17  84.45,73.03 270 top
D18  91.76,73.03 270 top
D19  96.84,73.03 270 top
D20  103.82,73.03 270 top
D21  100.97,34.92 270 top
D22  93.34,34.92 270 top
D23  88.27,34.92 270 top
D24  80.64,34.92 270 top
D25  103.5,34.92 90 top
D26  95.89,34.92 90 top
D27  90.81,34.92 90 top
D28  83.19,34.92 90 top
D29  50.8,34.92 270 top
D30  43.5,34.92 270 top
D31  38.42,34.92 270 top
D32  31.43,34.92 270 top
D33  53.34,34.92 90 top
D34  46.04,34.92 90 top
D35  40.96,34.92 90 top
D36  33.97,34.92 90 top
IC1  41.91,85.72 180 top
IC2  24.13,69.22 270 top
IC3  69.85,53.98 0 top
IC4  92.08,85.72 180 top
IC5  95.89,22.23 0 top
IC6  45.72,22.23 0 top
IC7  24.13,80.01 270 top
J1  19.68,57.78 270 top
J2  19.68,45.72 270 top
J3  19.68,33.66 270 top
J4  19.68,21.59 270 top
J5  3.81,62.23 180 top
JP1  117.47,88.27 180 top
JP2  67.31,88.27 180 top
JP3  66.67,19.68 0 top
JP4  116.2,19.68 0 top
K2  8.89,77.47 270 top
LED1  21.91,104.78 180 top
LED2  22.23,100.33 270 top
LED4  72.39,101.6 270 top
LED6  116.2,4.45 90 top
LED8  65.41,7.62 90 top
R1  83.19,60.96 0 top
R2  59.69,62.55 180 top
R3  80.01,46.99 0 top
R4  57.15,47.62 180 top
R5  73.66,78.11 90 top
R6  68.58,78.11 90 top
R7  63.5,78.11 90 top
R8  71.12,78.11 90 top
R9  66.04,78.11 90 top
R10  60.96,78.11 90 top
R11  123.19,76.83 90 top
R12  118.11,76.83 90 top
R13  25.4,73.03 270 top
R14  25.4,67.94 270 top
R15  113.03,76.83 90 top
R16  59.69,93.34 0 top
R17  120.65,76.83 90 top
R18  115.57,76.83 90 top
R19  110.49,76.83 90 top
R20  18.1,103.5 270 top
R21  30.48,92.71 180 top
R22  25.4,83.19 270 top
R23  80.64,92.71 180 top
R24  25.4,78.11 270 top
R25  109.86,93.34 0 top
R26  57.15,29.84 270 top
R27  62.23,29.84 270 top
R28  67.31,29.84 270 top
R29  59.69,29.84 270 top
R30  64.77,29.84 270 top
R31  69.85,29.84 270 top
R32  107.31,15.24 0 top
R34  78.11,14.61 180 top
R35  107.31,29.84 270 top
R36  112.39,29.84 270 top
R37  117.47,29.84 270 top
R38  109.86,29.84 270 top
R39  114.94,29.84 270 top
R40  120.02,29.84 270 top
R41  57.15,15.24 0 top
R43  27.94,14.61 180 top
RN1  31.75,94.61 0 top
RN2  12.7,39.69 270 top
RN3  81.92,94.61 0 top
RN4  106.05,13.34 180 top
RN5  55.88,13.34 180 top
S  33.02,100.97 180 top
S1  83.19,100.97 180 top
S2  104.78,6.99 0 top
S3  54.61,6.99 0 top
X1  102.87,100.01 0 top
X2  8.89,32.38 270 top
X3  52.7,100.01 0 top
X4  85.09,7.94 180 top
X5  34.92,7.94 180 top
X6  11.43,103.5 0 top

### Tracks (layer width: path | path; a pad name or v marks a point on that pad's centre or on a via)
+5V  (via drill 0.9 pad 1.6, 0.9 pad 1.7)
  Top 1: v23.5,56.2 v23.5,60.64 | v23.5,17.46 v23.5,53.98
  Bottom 0.6: IC2.2 18.41,69.22 C6.1 12.7,69.85 2.54,80.01 2.54,84.71 K2.1 | 52.07,9.53 IC6.20 52.07,23.5 C18.1 | S2.3 103.5,6.99 102.23,8.26 IC5.20 102.23,23.5 C15.1 | C12.1 85.72,85.09 IC4.20 85.72,99.38 | C1.1 35.56,85.09 IC1.20 35.56,99.38 | R16.2 62.23,95.89 65.41,99.06 65.41,101.28
  Bottom 0.61: RN2.1 13.34,51.75 13.34,56.2 17.46,60.33 23.18,60.33 v23.5,60.64
  Bottom 1: LED6.A S2.6 S2.5 S2.4 S2.3 | R14.2 25.4,62.55 v23.5,60.64 | R14.2 27.3,68.58 27.3,85.09 24.13,88.27 23.18,88.27 17.78,93.66 C7.+ 17.78,98.42 20.95,101.6 LED2.A LED1.A S.6 S.5 S.4 S.3 34.29,100.65 35.56,99.38 37.15,99.38 42.55,104.78 61.91,104.78 65.41,101.28 70.8,101.28 LED4.A 74.3,104.78 S1.6 S1.5 S1.4 S1.3 84.45,100.65 85.72,99.38 87.31,99.38 92.71,104.78 113.03,104.78 115.57,102.23 115.57,98.74 112.39,95.57 R25.2 | R14.2 22.86,69.22 IC2.2 | 73.66,6.35 73.66,10.79 75.56,12.7 R34.2 | 73.66,6.35 73.66,4.76 75.25,3.17 95.57,3.17 100.65,8.26 102.23,8.26 | 73.66,6.35 LED8.A 62.23,3.17 S3.6 S3.5 S3.4 S3.3 53.34,6.67 52.07,7.94 | 23.5,14.61 22.86,13.97 22.86,5.71 25.4,3.17 45.4,3.17 50.16,7.94 52.07,7.94 | 52.07,7.94 52.07,9.53 | 23.5,14.61 v23.5,17.46 | 23.5,14.61 R43.2 | IC3.14 30.48,57.78 29.21,56.52 23.81,56.52 v23.5,56.2 v23.5,53.98
+12V  (via drill 0.9 pad 1.7)
  Top 1: v19.68,75.56 19.37,74.93 v19.37,67.63
  Bottom 0.6: R24.2 23.81,78.42 23.81,79.69 23.5,80.01 IC7.2 | J5.2 5.08,62.87 6.03,63.82 12.7,63.82 14.29,65.41 C21.1 17.14,66.67 19.37,66.67
  Bottom 1: IC2.3 19.37,66.67 v19.37,67.63 | R24.2 24.13,75.56 v19.68,75.56
+24V  (via drill 0.9 pad 1.6, 0.9 pad 1.68, 0.9 pad 1.7, 1 pad 2)
  Top 1: v82.55,26.04 v100.97,26.04 | v32.38,26.35 v50.8,26.35 | v102.87,82.55 v85.09,82.55 | v52.7,82.23 v34.92,82.23
  Top 1.2: v70.48,27.94 v79.38,27.94 | v52.7,83.82 v58.74,83.82 | v102.87,84.45 v107.95,84.45 | v106.36,69.85 v106.36,77.47 | v55.24,70.8 v55.24,77.47
  Top 1.27: v36.83,41.27 v36.83,63.18 | v72.39,67.94 v80.64,67.94
  Top 1.5: v8.89,62.23 v8.89,67.94 | v31.75,63.5 v22.86,63.5
  Bottom 1: IC5.18 99.69,20.95 100.97,22.23 v100.97,26.04 | v82.55,26.04 87,21.59 IC5.8 | IC6.18 49.53,20.95 50.8,22.23 v50.8,26.35 | IC6.8 36.83,21.91 v32.38,26.35 | IC4.8 100.97,87 102.87,85.09 v102.87,82.55 | v85.09,82.55 85.41,82.55 87,84.14 87,85.72 88.27,87 IC4.18 | IC1.8 50.8,87 52.7,85.09 v52.7,82.23 | v34.92,82.23 36.83,84.14 36.83,85.72 38.1,87 IC1.18
  Bottom 1.2: D13.C 83.82,66.04 89.22,66.04 | 89.22,66.04 94.3,66.04 | 94.3,66.04 101.28,66.04 | 101.28,66.04 D16.C | 89.22,66.04 D14.C | 94.3,66.04 D15.C | v50.8,26.35 53.66,26.35 55.24,27.94 v70.48,27.94 70.48,26.04 72.39,24.13 72.39,17.14 C23.+ | v79.38,27.94 78.74,29.21 | C22.+ 121.92,16.83 121.92,24.77 120.65,26.04 v100.97,26.04 | C24.+ 64.77,93.34 62.23,90.81 62.23,88.27 58.74,84.77 v58.74,83.82 | v52.7,83.82 v52.7,82.23 52.7,80.64 53.34,80.01 53.98,80.01 55.24,78.74 v55.24,77.47 | C25.+ 115.57,93.34 112.39,90.17 112.39,88.9 v107.95,84.45 | v102.87,84.45 v102.87,82.55 102.87,80.64 103.5,80.01 104.46,80.01 106.36,78.11 v106.36,77.47 | v106.36,69.85 105.73,69.22 105.73,67.31 104.46,66.04 101.28,66.04 | 55.88,67.94 55.88,70.17 v55.24,70.8
  Bottom 1.27: D1.C 31.75,66.04 36.83,66.04 | 36.83,66.04 38.73,66.04 | 38.73,66.04 43.81,66.04 | 43.81,66.04 50.8,66.04 | 43.81,66.04 D3.C | 38.73,66.04 D2.C | 38.42,41.91 D31.C | 36.83,41.91 38.42,41.91 | 43.5,41.91 D30.C | 38.42,41.91 43.5,41.91 | D29.C 48.9,41.91 43.5,41.91 | 88.27,41.91 82.55,41.91 D24.C 80.64,35.56 78.74,33.66 78.74,29.21 80.64,27.3 81.28,27.3 v82.55,26.04 | 88.27,41.91 93.34,41.91 | 93.34,41.91 99.06,41.91 D21.C | 93.34,41.91 D22.C | 88.27,41.91 D23.C | v32.38,26.35 31.11,27.3 30.48,27.3 28.57,29.21 28.57,33.66 31.43,36.51 D32.C 33.34,41.91 36.83,41.91 | 36.83,41.91 v36.83,41.27 | v36.83,63.18 36.83,66.04 | 50.8,66.04 D4.C | 50.8,66.04 53.98,66.04 55.88,67.94 56.2,67.63 61.91,67.63 62.23,67.31 71.44,67.31 72.07,67.63 v72.39,67.94 | v80.64,67.94 D13.C
  Bottom 1.5: K2.S 2.86,72.71 2.86,71.44 6.35,67.94 v8.89,67.94 | v8.89,62.23 16.51,62.23 17.78,63.5 v22.86,63.5 | 31.75,66.04 v31.75,63.5
A-DIR  (via drill 0.8 pad 1.5)
  Top 0.6: v29.21,22.23 v53.34,22.23
  Bottom 0.6: X2.9 10.79,27.3 RN2.10 13.97,27.3 13.97,24.77 17.46,21.27 17.46,18.73 18.41,17.78 J4.1 20.32,17.78 24.45,22.23 v29.21,22.23 | v53.34,22.23 IC6.21
A-ENABLE  (via drill 0.8 pad 1.6)
  Top 0.6: v27.3,23.81 v31.43,23.81
  Bottom 0.6: v31.43,23.81 31.75,23.5 IC6.4 | J4.2 20.64,20.32 24.13,23.81 v27.3,23.81
A-STEP  (via drill 0.8 pad 1.5)
  Top 0.6: v28.89,38.42 28.89,44.77 v31.75,47.62
  Bottom 0.6: X2.8 11.75,30.8 RN2.9 13.97,30.8 15.24,29.53 15.24,25.4 17.78,22.86 J4.3 21.27,22.86 23.81,25.4 26.67,25.4 | 26.67,25.4 27.94,25.4 30.48,22.86 IC6.3 | D12.C R4.2 v31.75,47.62 | 26.67,25.4 26.67,36.2 v28.89,38.42
A-TQ  (via drill 0.8 pad 1.5, 0.9 pad 1.7)
  Top 0.6: v55.24,24.77 v55.24,46.35 | v50.8,6.35 v57.15,6.35
  Bottom 0.5: 66.04,46.99 66.04,48.9
  Bottom 0.6: S3.1 S3.2 v50.8,6.35 | 66.04,48.9 IC3.3 | v55.24,24.77 55.24,22.86 56.2,21.91 58.1,21.91 62.23,17.78 62.23,9.53 58.42,6.35 v57.15,6.35 | v55.24,46.35 57.15,46.35 57.78,45.72 64.77,45.72 66.04,46.99
DCY1
  Bottom 0.6: S.7 RN1.2 29.21,92.08 IC1.25
DCY2
  Bottom 0.6: S.8 RN1.3 29.21,93.34 30.48,92.08 IC1.24
DCY3
  Bottom 0.6: S1.7 RN3.2 76.83,93.34 IC4.25
DCY4
  Bottom 0.6: S1.8 RN3.3 79.38,93.98 80.64,92.71 IC4.24
DCY5
  Bottom 0.6: S2.7 RN4.2 111.12,14.61 IC5.25
DCY6
  Bottom 0.6: S2.8 RN4.3 108.58,14.61 107.31,15.88 IC5.24
DCY7
  Bottom 0.6: S3.7 RN5.2 58.42,15.88 IC6.25
DCY8
  Bottom 0.6: S3.8 RN5.3 57.78,14.61 57.15,15.24 IC6.24
ENABLE
  Bottom 0.6: 7.62,47.62 X2.14 11.11,47.62 11.43,47.62 RN2.2
GND  (via drill 0.9 pad 1.6, 1 pad 1.6, 3.2)
  Top 1: v89.22,24.13 v96.52,24.13 | v39.05,24.13 v46.35,24.13 | v18.73,89.53 v25.4,89.53 | v71.75,4.45 v71.75,8.26 | v69.85,99.69 v69.85,103.5 | v26.99,87.63 32.38,82.23 v32.38,81.28
  Bottom 0.6: IC1.10 C2.2 C3.2 | IC4.10 C14.2 C13.2 | IC6.10 C20.2 C19.2 | X2.19 7.62,33.66 | X2.20 X2.21 X2.22 | X2.22 7.62,25.4 | X2.22 X2.23 X2.24 | X2.24 7.62,19.68 | 7.62,17.14 X2.25 X2.24 | X2.18 7.62,36.83 8.89,36.83 | IC5.10 C17.2 C16.2 | C11.- 68.58,47.62 | 68.58,47.62 C10.- | IC3.7 77.47,50.8 | 68.58,47.62 68.58,51.44 | C8.- C9.- | v46.35,24.13 C18.2 | v96.52,24.13 C15.2 | 63.5,17.14 JP3.1 | RN3.1 74.61,94.3 74.61,91.44
  Bottom 0.8: 95.89,23.5 IC5.15 | 45.72,23.5 IC6.15
  Bottom 1: v96.52,24.13 95.89,23.5 | IC5.10 89.53,23.5 v89.22,24.13 85.09,27.94 | IC6.10 39.37,23.5 | v46.35,24.13 45.72,23.5
  Bottom 1.016: 39.37,23.5 v39.05,24.13
  Bottom 1.27: JP2.5 JP2.3 JP2.1 | JP1.5 JP1.3 JP1.1 | JP3.1 JP3.3 JP3.5 | D36.A 34.92,38.1 40.96,38.1 | 40.96,38.1 46.04,38.1 | 46.04,38.1 51.44,38.1 D33.A | 40.96,38.1 D35.A | 46.04,38.1 D34.A | 90.81,38.1 83.19,38.1 D28.A | 90.81,38.1 95.89,38.1 | 95.89,38.1 D26.A | 90.81,38.1 D27.A | D25.A 103.5,38.1 95.89,38.1 | JP4.1 JP4.3 JP4.5
  Bottom 1.5: X6.2 13.95,98.4 12.7,97.16 C7.-
  other vias: 66.67,3.17 66.67,104.78 3.17,104.78 122.56,104.78 122.56,3.17 3.17,3.17
  pour Bottom (isolate 0.28, hatched): 0,107.95 125.73,107.95 125.73,0 0,0
M1
  Bottom 0.6: S.9 RN1.4 IC1.23
M2
  Bottom 0.6: S.10 RN1.5 34.29,93.34 33.02,92.08 IC1.22
M3
  Bottom 0.6: S1.9 RN3.4 IC4.23
M4
  Bottom 0.6: S1.10 RN3.5 84.45,93.34 83.19,92.08 IC4.22
M5
  Bottom 0.6: S2.9 RN4.4 IC5.23
M6
  Bottom 0.6: S2.10 RN4.5 103.5,14.61 104.78,15.88 IC5.22
M7
  Bottom 0.6: S3.9 RN5.4 IC6.23
M8
  Bottom 0.6: IC6.22 54.61,15.88 53.34,14.61 RN5.5 S3.10
N$1
  Bottom 0.8: 46.99,81.28 IC1.11
  Bottom 1: 47.62,80.64 46.99,81.28
  Bottom 1.27: 63.5,73.66 R7.1 | 63.5,73.66 68.58,73.66 | 68.58,73.66 71.75,73.66 R5.1 | 68.58,73.66 R6.1 | 47.62,80.64 48.26,80.01 48.26,76.83 50.16,74.93 62.23,74.93 63.5,73.66
N$2
  Bottom 1: IC1.14 43.18,81.92 41.91,80.64 38.73,80.64 36.83,78.74 36.83,77.47
  Bottom 1.27: 66.04,69.85 R9.1 | 66.04,69.85 62.87,69.85 R10.1 59.37,73.34 49.21,73.34 46.99,75.56 38.73,75.56 36.83,77.47 | R8.1 69.22,69.85 66.04,69.85
N$3
  Bottom 1.27: R7.2 R10.2 R7.2 | R7.2 JP2.6
N$4
  Bottom 1.27: R6.2 R9.2 R6.2 | R6.2 67.31,84.45 JP2.4
N$5
  Bottom 1.27: R5.2 R8.2 JP2.2
N$6
  Bottom 0.8: IC6.11 40.64,26.99
  Bottom 1: 40.64,26.99 40.32,27.3
  Bottom 1.27: 62.23,38.1 59.05,38.1 R26.1 55.24,34.29 48.26,34.29 46.35,32.38 38.1,32.38 36.51,30.8 36.51,28.89 37.47,27.94 39.69,27.94 40.32,27.3 | 62.23,38.1 R27.1 | R28.1 65.41,38.1 62.23,38.1
N$7
  Bottom 1: IC6.14 44.45,27.3 45.09,27.94 46.67,27.94 47.94,29.21 47.94,30.8
  Bottom 1.27: 64.77,34.29 R30.1 | 64.77,34.29 67.94,34.29 R31.1 | 59.69,34.29 R29.1 | 59.69,34.29 64.77,34.29 | 47.94,30.8 49.53,32.38 56.2,32.38 58.1,34.29 59.69,34.29
N$8
  Bottom 1.27: R28.2 R31.2 69.22,23.5 JP3.6
N$9
  Bottom 0.6: IC1.7 52.07,91.44 C2.1
N$10
  Bottom 0.6: R21.1 38.73,92.71 39.37,92.08 IC1.17
N$11
  Bottom 0.6: IC7.1 24.77,82.55 R22.2 R24.1
N$12
  Bottom 0.6: 116.84,66.04 121.92,66.04 121.92,46.35 116.84,46.35 116.84,66.04
N$14
  Bottom 0.8: IC1.16 40.64,92.71 40.64,93.34 40.96,93.66
  Bottom 1: D5.C 34.29,79.38 38.1,83.19 38.1,84.77 40.64,87.31 IC1.16
  Bottom 1.27: D1.A D5.C | X3.1 45.09,97.79 40.96,93.66
N$15
  Bottom 0.8: 44.45,81.28 IC1.13
  Bottom 1: IC1.13 44.45,94.61 | D6.C 44.45,81.28
  Bottom 1.27: D2.A D6.C | X3.2 50.16,100.33 44.45,94.61
N$16
  Bottom 0.8: IC1.12 45.72,93.34
  Bottom 1: 45.72,93.34 46.35,93.98 | D3.A 45.72,78.11 IC1.12
  Bottom 1.27: D3.A D7.C | X3.3 55.24,100.33 52.07,97.16 49.53,97.16 46.35,93.98
N$17
  Bottom 0.8: 49.53,86.36 IC1.9
  Bottom 1: D4.A 50.8,85.09 49.53,86.36
  Bottom 1.27: D4.A D8.C | IC1.9 49.53,91.44 54.61,97.16 58.42,97.16 60.33,99.06 60.33,100.97 X3.4
N$19
  Bottom 1.5: IC7.3 19.05,77.47 C5.1 17.14,79.38 13.34,79.38 8.89,83.82 K2.P 8.89,88.9 7.62,90.17 C4.+ 7.62,97.47 8.91,98.77 X6.1
N$20
  Bottom 0.6: IC2.1 R13.2 R14.1
N$21
  Bottom 0.6: IC3.13 IC3.12 C8.+ 64.77,60.33 | 64.77,60.33 64.45,60.64 D9.A | 64.77,60.33 R2.1
N$22
  Bottom 0.6: IC3.9 IC3.10 IC3.9 | IC3.9 C9.+ 77.47,60.33 R1.1 80.64,58.42 D10.A
N$23
  Bottom 0.6: R20.2 LED1.K
N$24
  Bottom 0.6: R21.2 22.23,93.34 LED2.K
N$26
  Bottom 0.6: IC3.5 IC3.4 IC3.5 | IC3.5 C10.+ | D11.A R3.1 74.3,47.62 C10.+ | IC3.5 C10.+
N$27
  Bottom 0.6: IC3.1 IC3.2 C11.+ | R4.1 IC3.1 | IC3.1 D12.A
N$28
  Bottom 0.6: IC1.5 54.61,91.76 55.24,92.39 | 55.24,92.39 C3.1 | 55.24,92.39 55.24,93.34 R16.1
N$29
  Bottom 0.8: 97.16,80.64 IC4.11
  Bottom 1: 97.47,80.33 97.16,80.64
  Bottom 1.27: 113.03,72.39 R15.1 | 113.03,72.39 118.11,72.39 | 118.11,72.39 121.28,72.39 R11.1 | 118.11,72.39 R12.1 | 97.47,80.33 98.74,79.06 98.74,76.83 101.28,74.3 111.12,74.3 113.03,72.39
N$30
  Bottom 1: IC4.14 93.34,81.92 91.44,80.01 88.27,80.01 87.31,79.06 87.31,76.83
  Bottom 1.27: 115.57,68.58 112.39,68.58 R19.1 108.58,72.39 100.33,72.39 97.16,75.56 88.58,75.56 87.31,76.83 | 115.57,68.58 118.75,68.58 R17.1 | 115.57,68.58 R18.1
N$31
  Bottom 1.27: R19.2 R15.2 JP1.6
N$32
  Bottom 1.27: R27.2 R30.2 JP3.4
N$33
  Bottom 1.27: R18.2 R12.2 117.47,83.19 JP1.4
N$34
  Bottom 1.27: R17.2 R11.2 R17.2 | R17.2 JP1.2
N$35
  Bottom 1.27: R26.2 R29.2 62.23,20.95 JP3.2
N$36
  Bottom 0.8: IC5.11 90.81,26.67
  Bottom 1: 90.81,26.67 90.17,27.3
  Bottom 1.27: 112.39,38.1 109.22,38.1 R35.1 105.41,34.29 98.42,34.29 96.52,32.38 88.27,32.38 86.36,30.48 86.36,29.21 87.63,27.94 89.53,27.94 90.17,27.3 | 112.39,38.1 115.57,38.1 R37.1 | 112.39,38.1 R36.1
N$37
  Bottom 0.8: IC4.16 90.81,93.03 90.81,93.34 91.12,93.66
  Bottom 1: D17.C 84.45,79.38 88.27,83.19 88.27,84.77 90.81,87.31 IC4.16
  Bottom 1.2: 91.12,93.66 95.25,97.79
  Bottom 1.27: D13.A D17.C | X1.1 95.25,100.97 95.25,97.79
N$38
  Bottom 0.8: 94.61,80.96 IC4.13
  Bottom 1: D18.C 94.61,80.96
  Bottom 1.2: IC4.13 94.3,91.12 94.3,94.3 100.33,100.33
  Bottom 1.27: D14.A D18.C | 100.33,100.33 X1.2
N$39
  Bottom 0.8: IC4.12 95.89,93.34
  Bottom 1: D15.A 95.89,78.11 IC4.12 | 95.89,93.34 97.16,94.61
  Bottom 1.2: 97.16,94.61 99.69,97.16 102.23,97.16 105.41,100.33
  Bottom 1.27: D15.A D19.C | 105.41,100.33 X1.3
N$40
  Bottom 0.8: 99.69,86.36 IC4.9
  Bottom 1: D16.A 100.97,78.42 100.97,85.09 99.69,86.36
  Bottom 1.2: IC4.9 99.69,91.44 104.78,97.16 107.95,97.16 110.17,99.38
  Bottom 1.27: D16.A D20.C | 110.17,99.38 X1.4
N$41
  Bottom 0.6: R23.2 73.03,99.69 LED4.K
N$43
  Bottom 0.6: IC4.7 102.23,91.44 C14.1
N$44
  Bottom 0.6: IC4.5 104.78,91.76 105.41,92.39 | 105.41,92.39 C13.1 | 105.41,92.39 105.41,93.34 R25.1
N$45
  Bottom 0.6: R23.1 88.9,92.71 89.53,92.08 IC4.17
N$47
  Bottom 1: IC5.14 94.61,26.04 97.79,29.21 97.79,30.48
  Bottom 1.27: 109.86,34.29 R38.1 | 109.86,34.29 114.94,34.29 | 114.94,34.29 118.11,34.29 R40.1 | 114.94,34.29 R39.1 | 97.79,30.48 99.38,32.38 107.95,32.38 109.86,34.29
N$48
  Bottom 1.27: R37.2 R40.2 118.75,23.5 JP4.6
N$49
  Bottom 1.27: R36.2 R39.2 JP4.4
N$50
  Bottom 1.27: R35.2 R38.2 112.39,20.95 JP4.2
N$55
  Bottom 0.8: 97.16,15.88 IC5.16
  Bottom 0.9: 96.52,14.92 97.16,15.88
  Bottom 1: D25.C D21.A 100.97,29.21 100.97,28.89 99.38,27.3 99.38,22.54 97.16,20.32 IC5.16
  Bottom 1.27: D21.A D25.C | X4.1 92.71,9.53 96.52,13.34 96.52,14.92
N$56
  Bottom 0.8: IC5.13 D22.A
  Bottom 1: D22.A D26.C
  Bottom 1.27: D22.A D26.C 94.61,29.84 | X4.2 88.27,8.26 93.34,13.34 IC5.13
N$57
  Bottom 0.8: IC5.12 92.08,14.61 91.44,13.97
  Bottom 1: IC5.12 92.08,28.57 D27.C D23.A
  Bottom 1.27: D27.C D23.A | 91.44,13.97 88.27,10.79 85.72,10.79 82.55,7.62 X4.3
N$58
  Bottom 0.8: IC5.9 88.27,22.86
  Bottom 1: 88.27,22.86 83.19,27.94 D28.C D24.A
  Bottom 1.27: D28.C D24.A | X4.4 77.79,8.26 80.33,10.79 83.19,10.79 88.27,16.51 IC5.9
N$59
  Bottom 0.6: R32.2 114.94,6.99 LED6.K
N$61
  Bottom 0.6: IC5.7 85.72,16.51 C17.1
N$62
  Bottom 0.6: 82.55,15.56 83.19,16.19 IC5.5 | 82.55,15.56 C16.1 | R34.1 82.55,14.61 82.55,15.56
N$63
  Bottom 0.6: R32.1 99.06,15.24 98.42,15.88 IC5.17
N$73
  Bottom 0.8: 46.99,15.24 IC6.16
  Bottom 1: D33.C D29.A 50.8,29.21 49.21,27.62 49.21,23.18 46.99,20.95 IC6.16
  Bottom 1.27: D29.A D33.C | 46.99,15.24 42.55,10.79 42.55,6.99 X5.1
N$74
  Bottom 0.8: IC6.13 43.18,29.21 43.18,29.53 D30.A
  Bottom 1: D30.A D34.C
  Bottom 1.27: X5.2 37.47,8.57 43.18,14.29 IC6.13 | D30.A D34.C
N$75
  Bottom 0.8: 41.27,14.61 41.91,15.24 IC6.12
  Bottom 1: IC6.12 41.91,28.57 D35.C D31.A
  Bottom 1.27: D35.C D31.A | X5.3 32.38,7.94 35.24,10.79 37.47,10.79 41.27,14.61
N$76
  Bottom 0.8: IC6.9 38.1,22.86
  Bottom 1: 38.1,22.86 33.97,26.99 D36.C D32.A
  Bottom 1.27: D36.C D32.A | X5.4 27.3,7.62 30.48,10.79 32.38,10.79 38.1,16.51 IC6.9
N$77
  Bottom 0.6: LED8.K 64.77,9.53 R41.2
N$79
  Bottom 0.6: IC6.7 35.56,16.51 C20.1
N$80
  Bottom 0.6: 31.75,14.61 33.02,15.88 IC6.5 | 31.75,14.61 C19.1 | R43.1 31.75,14.61
N$81
  Bottom 0.6: IC6.17 48.26,16.51 R41.1
TQ1
  Bottom 0.6: RN1.6 S.11 43.18,103.5 61.28,103.5 63.5,101.28 63.5,98.42 60.33,95.25 60.33,92.39 59.69,91.76 59.69,91.44 IC1.1
TQ2
  Bottom 0.6: RN1.7 S.12 39.37,98.11 43.81,102.55 60.96,102.55 62.23,101.28 62.23,98.42 59.05,95.25 59.05,93.03 58.42,92.39 58.42,91.76 IC1.2
TQ3
  Bottom 0.6: RN3.6 S1.11 93.34,103.5 112.08,103.5 113.67,101.92 113.67,98.74 110.49,95.25 110.49,92.71 109.86,92.08 IC4.1
TQ4
  Bottom 0.6: RN3.7 S1.12 89.53,97.79 94.3,102.55 111.12,102.55 112.39,101.28 112.39,98.74 109.22,95.25 109.22,92.71 108.58,92.08 IC4.2
TQ5
  Bottom 0.6: RN4.6 S2.11 100.65,10.16 94.93,4.45 75.88,4.45 74.93,5.4 74.93,10.16 77.47,12.7 77.47,15.56 78.11,16.19 IC5.1
TQ6
  Bottom 0.6: RN4.7 S2.12 98.42,10.16 93.66,5.4 76.52,5.4 75.88,6.03 75.88,9.53 78.74,12.7 78.74,15.24 79.38,15.88 IC5.2
TQ7
  Bottom 0.6: RN5.6 S3.11 50.8,10.48 44.77,4.45 26.04,4.45 24.45,6.03 24.45,9.84 27.3,12.7 27.3,15.24 27.94,15.88 IC6.1
TQ8
  Bottom 0.6: RN5.7 S3.12 48.26,10.16 43.5,5.4 26.35,5.4 25.72,6.03 25.72,9.84 28.57,12.7 28.57,15.24 29.21,15.88 IC6.2
X-DIR  (via drill 0.8 pad 1.5)
  Top 0.6: v78.74,22.23 v103.5,22.23
  Bottom 0.6: X2.7 RN2.8 14.29,33.34 17.78,29.84 J3.1 21.59,29.84 23.5,31.75 23.5,35.88 31.43,43.81 52.07,43.81 54.61,41.27 71.12,41.27 74.3,38.1 74.3,24.77 76.83,22.23 v78.74,22.23 | v103.5,22.23 IC5.21
X-ENABLE  (via drill 0.8 pad 1.5)
  Top 0.6: v76.83,24.13 v80.64,24.13
  Bottom 0.6: J3.2 20.32,32.38 22.23,34.29 22.23,35.88 31.11,44.77 52.39,44.77 54.93,42.23 71.75,42.23 75.25,38.73 75.25,25.72 v76.83,24.13 | v80.64,24.13 81.92,22.86 IC5.4
X-STEP
  Bottom 0.6: X2.6 12.06,36.2 RN2.7 15.56,35.88 16.51,34.92 J3.3 20,34.92 30.8,45.72 52.7,45.72 55.24,43.18 72.39,43.18 76.2,39.37 | IC5.3 80.64,22.23 76.2,26.67 76.2,39.37 | R3.2 83.82,46.99 82.55,45.72 D11.C 81.92,45.09 76.2,39.37
X-TQ  (via drill 0.8 pad 1.5)
  Top 0.6: v100.97,6.03 102.55,7.62 v117.47,7.62
  Bottom 0.6: S2.1 S2.2 v100.97,6.03 | IC3.6 76.83,48.26 78.74,48.26 79.69,49.21 110.17,49.21 124.46,34.92 124.46,9.53 121.92,6.99 118.11,6.99 v117.47,7.62
Y-DIR  (via drill 0.8 pad 1.5)
  Top 0.6: v48.26,51.12 v48.26,62.23
  Bottom 0.6: X2.5 11.11,38.42 RN2.6 13.65,38.42 17.14,41.91 J2.1 22.86,41.91 32.38,51.44 47.94,51.44 v48.26,51.12 | v48.26,62.23 50.16,64.14 55.24,64.14 56.83,65.72 60.64,65.72 61.59,64.77 72.39,64.77 79.38,71.75 79.38,81.92 80.64,83.19 82.55,83.19 83.5,84.14 83.5,86.04 84.45,87 IC4.21
Y-ENABLE  (via drill 0.8 pad 1.5)
  Top 0.6: v109.22,66.04 v109.22,78.11
  Bottom 0.6: v109.22,66.04 109.22,65.41 96.84,53.02 31.75,53.02 23.18,44.45 J2.2 | v109.22,78.11 105.09,82.23 105.09,86.36 106.05,87.31 IC4.4
Y-STEP  (via drill 0.8 pad 1.5)
  Top 0.6: v107.95,67.63 v107.95,81.28
  Bottom 0.6: X2.4 11.43,40.96 RN2.5 13.65,40.96 17.46,44.77 17.46,45.4 19.05,46.99 J2.3 24.45,46.99 31.43,53.98 88.27,53.98 | 88.27,53.98 96.52,53.98 107.95,65.41 v107.95,67.63 | v107.95,81.28 106.05,83.19 106.05,85.72 107.31,87 IC4.3 | R1.2 D10.C 88.27,53.98
Y-TQ  (via drill 0.8 pad 1.5)
  Top 0.6: v80.64,80.64 v80.64,85.72 | v81.92,101.28 v86.04,101.28
  Bottom 0.6: S1.1 S1.2 87,103.5 86.04,102.55 v86.04,101.28 | IC3.8 77.47,56.83 78.74,55.56 82.87,55.56 83.82,56.52 83.82,60.33 78.42,65.72 78.42,69.53 80.33,71.44 80.33,80.01 80.33,80.33 v80.64,80.64 | v80.64,85.72 75.56,90.81 75.56,99.69 77.15,101.28 v81.92,101.28
Z-DIR  (via drill 0.8 pad 1.5)
  Top 0.6: v27.3,53.02 v27.3,60.33
  Bottom 0.6: X2.3 11.43,43.5 RN2.4 13.65,43.5 15.88,45.72 15.88,46.99 17.46,48.58 17.46,53.02 18.41,53.98 J1.1 20.32,53.98 23.18,51.12 25.4,51.12 v27.3,53.02 | v27.3,60.33 27.62,60.64 27.62,65.09 29.53,66.99 29.53,80.96 34.29,85.72 IC1.21
Z-ENABLE  (via drill 0.8 pad 1.5)
  Top 0.6: v59.05,64.45 v59.05,80.64
  Bottom 0.6: v59.05,64.45 59.05,62.23 55.88,59.05 29.84,59.05 28.57,57.78 22.86,57.78 21.59,56.52 J1.2 | v59.05,80.64 56.52,80.64 55.88,81.28 IC1.4
Z-STEP  (via drill 0.8 pad 1.5)
  Top 0.6: v57.15,63.82 v57.15,81.92
  Bottom 0.6: X2.2 11.43,46.04 RN2.3 14.61,47.94 14.61,55.88 17.78,59.05 J1.3 28.57,59.05 29.53,60.01 53.98,60.01 D9.C | D9.C R2.2 | R2.2 55.88,62.55 v57.15,63.82 | v57.15,81.92 IC1.3 | D9.C R2.2
Z-TQ  (via drill 0.8 pad 1.5)
  Top 0.6: v25.4,54.61 v25.4,60.33 | v31.43,101.6 v35.88,101.6
  Bottom 0.6: S.1 S.2 36.83,103.5 35.88,102.55 v35.88,101.6 | IC3.11 69.85,56.52 69.22,55.88 61.28,55.88 60.64,56.52 31.11,56.52 29.84,55.24 26.04,55.24 v25.4,54.61 | v25.4,60.33 26.67,61.59 26.67,65.72 28.57,67.63 28.57,88.9 25.4,92.08 25.4,99.69 27.3,101.6 v31.43,101.6

### Text on the board
Bottom: MS-v4.1